# Altium project HW_SSB_LITE_R1.PrjPcb (part 1 of 2)
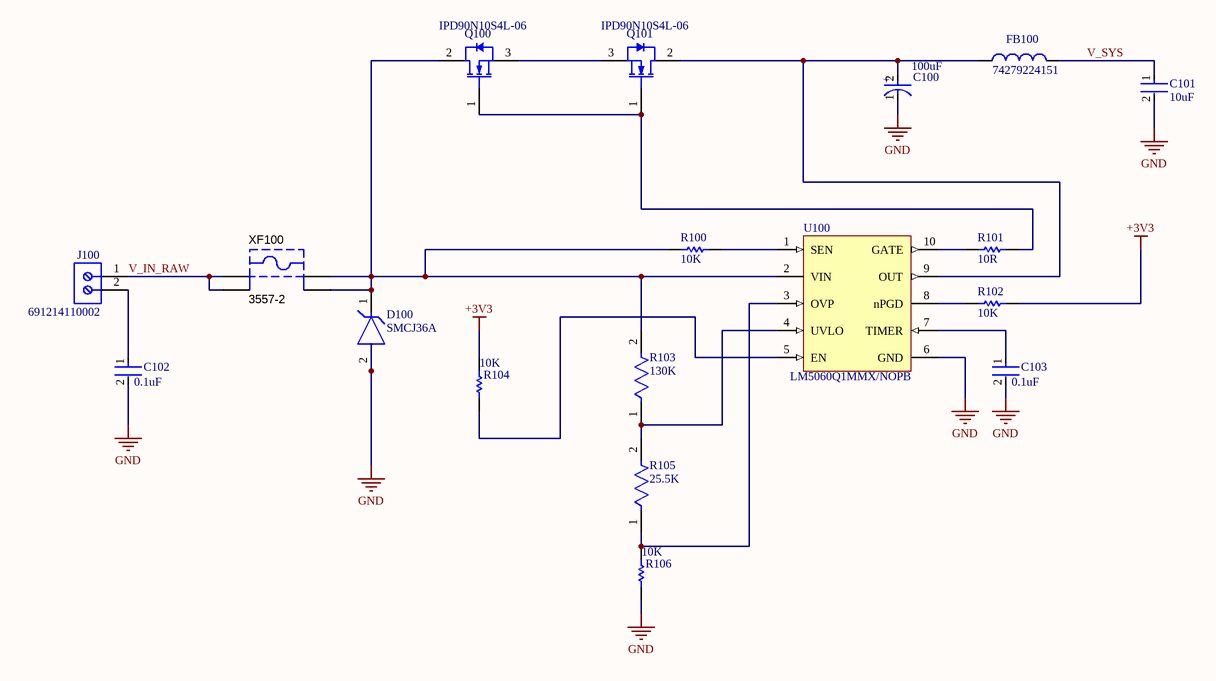
[diagram p0: Sheet1.SchDoc]
6 sheets, 147 parts. Net scope: global (net labels, ports and power ports of the same name join across sheets).
Board file: HW_SSB.PcbDoc
Sheets:
  Sheet1.SchDoc
  Sheet2.SchDoc
  Sheet3.SchDoc
  Sheet4.SchDoc
  Sheet5.SchDoc
  Sheet6.SchDoc

## Sheet Sheet1.SchDoc
size A4; SheetNumber: 1; SheetTotal: 6

### Parts
C100  100uF  [FP-RAD-TH-D_8_0_5-L_11_5-MFG]
C101  10uF  [FP-C3225-250-0_4-IPC_A]
C102  0.1uF  [FP-C1206C-EB-MFG]
C103  0.1uF  [FP-C1206C-EB-MFG]
D100  SMCJ36A  [FP-SMCJ-MFG]
FB100  74279224151  [WE-MPSB_2220_L5.6W5.1H1.8]
J100  691214110002  [691214110002]
Q100  IPD90N10S4L-06  [INF-PG-TO252-3-313_M]
Q101  IPD90N10S4L-06  [INF-PG-TO252-3-313_M]
R100  10K  [RESC1609X50X30NL8T20]
R101  10R  [RESC1608X55X25NL10T15]
R102  10K  [RESC1609X50X30NL8T20]
R103  130K  [FP-CRCW0603-e3-IPC_C]
R104  10K  [RESC1609X50X30NL8T20]
R105  25.5K  [FP-CRCW0603-e3-IPC_A]
R106  10K  [RESC1609X50X30NL8T20]
U100  LM5060Q1MMX/NOPB  [DGS0010A_M]
XF100  3557-2  [KSTN-3557-2]

### Nets
+3V3: R102.1 R104.2  [project net ESP_SCL]
GND: C100.1(C) C101.2 C102.2 C103.2 D100.2(A) R106.1 U100.6(GND)
V_SYS: C101.1 FB100.2
V_IN_RAW: J100.1 XF100.1 XF100.2
NetC100_2: C100.2(A) FB100.1 Q101.2(DRAIN) U100.9(OUT)
NetC102_1: C102.1 J100.2
NetC103_1: C103.1 U100.7(TIMER)
NetD100_1: D100.1(C) Q100.2(DRAIN) R100.2 R103.2 U100.2(VIN) XF100.3 XF100.4
NetQ100_1: Q100.1(GATE) Q101.1(GATE) R101.2
NetQ100_3: Q100.3(SOURCE) Q101.3(SOURCE)
NetR100_1: R100.1 U100.1(SEN)
NetR101_1: R101.1 U100.10(GATE)
NetR102_2: R102.2 U100.8(nPGD)
NetR103_1: R103.1 R105.2 U100.4(UVLO)
NetR104_1: R104.1 U100.5(EN)
NetR105_1: R105.1 R106.2 U100.3(OVP)

### Notes on the sheet
- (in symbol CMP-05427-002079-1) +

### Library data of the parts
C100 = CMP-05427-002079-1: Aluminum Electrolytic Capacitors (Radial Lead Type) 100uF ±20% 50V; ESR (Equivalent Series Resistance): 61mR; Lead Diameter: 0.6mm; Ripple Current (AC): 870mA; Life (Hours): 6000Hour; Lead/Base Style: Straight; Height - Seated (Max): 0.512inch; Height: 11.5mm; REACH SVHC: No SVHC; Contact Plating: Tin; Impedance: 61mR; Capacitance: 100uF; Voltage: 50V; Termination: Radial; Series: FR; Voltage Rating: 50V; Lead Pitch: 3.5mm; Diameter: 8mm; Number of Pins: 2; Min Operating Temperature: -40°C; Mount: Through Hole; Ripple Current: 870mA; Radiation Hardening: No; Length: 11.5mm; Max Operating Temperature: 105°C; Construction: RADIAL; Packaging: Bulk; Package Quantity: 200; Case/Package: Radial; RoHS Compliant: Yes; Voltage Rating (DC): 50V; Tolerance: 20%
C101 = CMP-08246-007101-1: Multilayer Ceramic Capacitors 10uF ±10% 50V X7R SMD 1210; RoHS Compliant: Yes
C102 C103 = CMP-03020-005759-1: CAP CER 0.1UF 50V X7R 1206; Manufacturer: KEMET; Manufacturer Part Number: C1206C104K5RACAUTO; Capacitance: 0.10 μF; Temperature Coefficient: 15%; Value: 0.10 μF; Material: Ceramic; Automotive Grade: Grade 0; Tolerance: 0.1; RoHS: TRUE; Lead Free: Yes; ComponentLink2Description: Datasheet; Automotive: Yes; Temperature Characteristic: X7R; Temperature Range Low: -55°C; Voltage Rating: 50 V; Device Class L1: Passive Components; Ipc Land Pattern Name: CAPC320160X78; Mouser Description: Multilayer Ceramic Capacitors MLCC - SMD/SMT 0.1uF 50volts 10% X7R AUTO; Octopart: https://octopart.com/c1206c104k5racauto-kemet-12595586; Device Class L3: Ceramic Capacitors; Digikey Description: CAP CER 0.1UF 50V X7R 1206; Temperature Range High: +150°C; Temperature: -55°C to +150°C; Device Class L2: Capacitors; ComponentLink2URL: https://content.kemet.com/datasheets/KEM_C1007_X8R_ULTRA_150C_SMD.pdf; Package: C1206C-EB; Category: Cap; Height: 0.88mm
D100 = CMP-2000-07108-2: TVS DIODE 36V 58.1V DO214AB; Max Reverse Leakage Current: 1uA; Max Surge Current: 25.9A; Min Breakdown Voltage: 40V; Peak Pulse Power: 1.5kW; Polarity: Unidirectional; Number of Elements: 1; Max Power Dissipation: 6.5W; Max Breakdown Voltage: 44.2V; Power Line Protection: No; Test Current: 1mA; Element Configuration: Single; Case/Package: SMC; Peak Pulse Current: 25.9A; Length: 7.11mm; Height: 2.417mm; Power Dissipation: 1.5kW; Max Operating Temperature: 150°C; Direction: Unidirectional; Min Operating Temperature: -65°C; Operating Supply Voltage: 36V; Breakdown Voltage: 40V; Reverse Standoff Voltage: 36V; REACH SVHC: No SVHC; Lead Free: Lead Free; Voltage Rating (DC): 36V; Number of Channels: 1; Number of Unidirectional Channels: 1; Mount: Surface Mount; Clamping Voltage: 58.1V; Number of Pins: 2; Composition: Zener; Termination: SMD/SMT; Reverse Breakdown Voltage: 40V; Leakage Current: 1uA; Width: 6.22mm; Radiation Hardening: No; Packaging: Tape and Reel; Package Quantity: 3000
FB100 = CMP-1413-00001-2: NexarPartId: 21273886; Current Rating: 5A; Tolerance: 25%; Number of Lines: 1; Frequency: 700MHz; DC Resistance (DCR): 7mΩ; Test Frequency: 100MHz; Material: Ferrite, Steel; Impedance: 150Ω; Max Operating Temperature: 125°C; Length: 5.6mm; Width: 5.1mm; Height: 1.8mm; Max DC Current: 5A; Case Code (Metric): 5650; RoHS: Compliant; Termination: SMD/SMT; Packaging: Digi-Reel®; Depth: 5.08mm; Max Current Rating: 5A; REACH SVHC: Unknown; Case Code (Imperial): 2220; Min Operating Temperature: -55°C; Case/Package: 2220; Mount: Surface Mount
J100 = CMP-1502-02464-3: 2141 Series 3.5MM Pitch Straight, Pcb Terminal Block, Through Hole, 2 Way; Plating: Brass, Steel; Wire Gauge (Min): 16AWG; Number of Contacts: 2; Current: 10A; Stripping Length: -6mm; Voltage Rating: 300V; Pitch: 3.5052mm; Wire Gauge (Max): 24AWG; Number of Levels: 1; Lead Pitch: 3.5mm; Width: 7.9mm; Packaging: Box; RoHS: Compliant; Number of Rows: 1; Min Operating Temperature: -40°C; Mount: Through Hole; Number of Pins: 2; Contact Plating: Brass, Tin; Housing Material: Nylon; Current Rating: 10A; Termination: Screw; Color: Blue, Green; Number of Positions Per Level: 2; Height: 8.7mm; Voltage: 300V; Max Operating Temperature: 105°C; Wire/Cable Gauge: 24AWG; Length: 7.4mm; Contact Material: Tin
Q100 Q101 = CMP-1138-00161-1: OptiMOS-T2 Power-Transistor, 100 V VDS, 90 A ID, PG-TO252-3-313, Reel, Green; Manufacturer: Infineon; RthJC (max): 1.1 K/W; VGS(th) (min): 1.1 V; IDpuls (max): 360 A; VDS (max): 100 V; RDS (on) (max) (@4.5V): 8.1 mOhm; ID (max): 90 A; Ptot (max): 136 W; RDS (on) (max) (@10V): 6.6 mOhm; Green: TRUE; VGS(th) (max): 2.1 V; QG: 75 nC; Halogen-free: TRUE; PackageVersion: Oct-10; Mounting Technology: Surface Mount; ComponentLink1Description: Manufacturer URL; ComponentLink2Description: Datasheet; ComponentLink1URL: http://www.infineon.com/; PackageReference: PG-TO252-3-313; Technology: OptiMOS-T2; ComponentLink3Description: Package Specification; Packing: Reel; DatasheetVersion: Rev. 1.0; ComponentLink3URL: http://www.infineon.com/dgdl/PG-TO252-3-313-Package_Overview.pdf?folderId=db3a30432b57a660012b81890ade72d2&fileId=db3a30432b57a660012b8193af2872eb; PackageDescription: 3-Pin Plastic (Green) Transistor Single Outline Package, 6.5 x 6.12 mm Body, 2.28 mm Pitch; ComponentLink2URL: http://www.infineon.com/dgdl/IPD90N10S4L-06_DS_1_0.pdf?folderId=db3a3043156fd5730115c7d50620107c&fileId=db3a3043372d5cc80137500063630512&location=en.Products.Automotive_ICs.Automotive_MOSFETs.Single__N-Channel_100V_MOSFETs.DATASHEET.IPD90N10S4L-06_DS_1_0.p; PartNumber: IPD90N10S4L-06
R100 R102 R104 R106 = CMP-1666-00005-4: Chip Resistor, 10 KOhm, +/- 1%, 100 mW, -55 to 155 degC, 0603 (1608 Metric), RoHS, Tape and Reel; Manufacturer: Vishay Semiconductor; Voltage Rating: 75 V; Max Operating Temperature: 155 degC; PackageDescription: 2-Pin Surface Mount Device, Body 1.575 x 0.85 mm; ComponentLink1Description: Manufacturer URL; RoHSCompliant: true; PackageReference: 0603; REACH SVHC: Unknown; Length: 1.55 mm; DatasheetVersion: 06/2012; Packaging: Tape and Reel; Min Operating Temperature: -55 degC; Mounting Technology: Surface Mount; ComponentLink2URL: https://datasheet.ciiva.com/11809/0900766b80d98afc-11809037.pdf; Height: 0.45 mm; ComponentLink2Description: Datasheet; Package Quantity: 5000; ComponentLink1URL: http://www.vishay.com/
R101 = CMP-1659-00008-4: Chip Resistor, 10 Ohm, +/- 1%, 0.1 W, -55 to 155 degC, 0603 (1608 Metric), RoHS, Tape and Reel; Manufacturer: Yageo; Voltage Rating: 50 V; PackageReference: 0603; ComponentLink3Description: Package Specification; Packaging: Tape and Reel; Max Operating Temperature: 155 degC; ComponentLink3URL: http://www.farnell.com/datasheets/443971.pdf; PackageDescription: 2-Pin Surface Mount Device, Body 1.6 x 0.8 mm; ComponentLink1URL: http://www.yageo.com/; Pins: 2; REACH SVHC: No SVHC; RoHSCompliant: true; ComponentLink2URL: http://www.yageo.com/documents/recent/PYu-RC_Group_51_RoHS_L_04.pdf; DatasheetVersion: Rev. 4, 02/2016; Mount: Surface Mount; Package Quantity: 200; Min Operating Temperature: -55 degC; Height: 0.45 mm; Mounting Technology: Surface Mount; ComponentLink1Description: Manufacturer URL; ComponentLink2Description: Datasheet; Length: 1.6 mm
R103 = CMP-2000-03887-2: RES Thick Film, 130kΩ, 1%, 0.1W, 100ppm/°C, 0603; Resistance: 130kR; Power Rating: 100mW; Voltage Rating: 75V; Width: 0.033inch; Lead Free: Lead Free; Case Code (Imperial): 0603; Radiation Hardening: No; Termination: SMD/SMT; Tolerance: 1%; Packaging: Tape and Reel; Length: 1.55mm; Height: 0.45mm; Composition: Thick Film; Max Power Dissipation: 100mW; Max Operating Temperature: 155°C; Temperature Coefficient: 100ppm/°C; Voltage Rating (DC): 75V; Case Code (Metric): 1608; Case/Package: 0603; Military Standard: Not; Features: Automotive AEC-Q200; Number of Pins: 2; Weight: 7.1E-05oz; Min Operating Temperature: -55°C; Depth: 0.85mm; Number of Terminations: 2; Contact Plating: Tin; Package Quantity: 10
R105 = CMP-2000-03129-2: RES Thick Film, 25.5kΩ, 1%, 0.1W, 100ppm/°C, 0603; Power Rating: 100mW; Voltage Rating (DC): 75V; Resistance: 25.5kR; Termination: SMD/SMT; Temperature Coefficient: 100ppm/°C; Lead Free: Lead Free; Features: Automotive AEC-Q200; Case/Package: 0603; Width: 0.033inch; Min Operating Temperature: -55°C; Number of Pins: 2; Package Quantity: 10; Case Code (Metric): 1608; Military Standard: Not; Case Code (Imperial): 0603; Length: 1.55mm; Composition: Thick Film; Max Operating Temperature: 155°C; Height: 0.45mm; Number of Terminations: 2; Packaging: Tape and Reel; Radiation Hardening: No; Depth: 0.85mm; Tolerance: 1%; Contact Plating: Tin; Working Voltage: 75V; Weight: 7.1E-05oz; Max Power Dissipation: 100mW; Voltage Rating: 75V
U100 = CMP-0069-01838-4: High-Side Protection Controller with Low Quiescent Current, 10-pin MSOP, Pb-Free; Manufacturer: Texas Instruments; PackageTopMarking: ZXTT*SZAB; High-Reliability: Y; CompType: Switcher; PackageDescription: Mini-SO, Molded, .118 x .118 x .034in Body, 10 Lead, .0197in Pitch; PowerWise: Y; PinCount: 10; Code_JEDEC: MO-187-BA; ComponentLink1URL: http://www.ti.com/general/docs/lit/getliterature.tsp?genericPartNumber=LM5060-Q1&fileType=pdf; ComponentLink1Description: Datasheet URL; PackageReference: DGS0010A; RoHS: Y; PartNumber: LM5060Q1MMX/NOPB
XF100 = CMP-2000-05461-1: FUSE HOLDER, PCB MOUNT, 500VAC, 20A, ROHS; Manufacturer: Keystone-Electronics; Number of Circuits: 1; Voltage: 500V; Fuseholder Type: Block; Fuse Type: Blade; Fuse Size: 0.43"Lx0.15"Wx0.64"H(10.92mmx3.81mmx16.25mm); For Use With/Related Products: ATC,ATO257,MINI897; Current Rating: 30A; Datasheet URL: http://datasheet.octopart.com/3557-2-Keystone-datasheet-15715937.pdf; Orientation: Vertical; Family: Fuseholders; Datasheet Version: Apr-13; Contact Finish: TinNickel; Mounting Type: PCB; Series: -; Category: CircuitProtection; Termination Style: PCPin; Contact Material: Brass; Manufacturer URL: http://www.keyelco.com/

## Sheet Sheet2.SchDoc
size A4; SheetNumber: 2; SheetTotal: 6
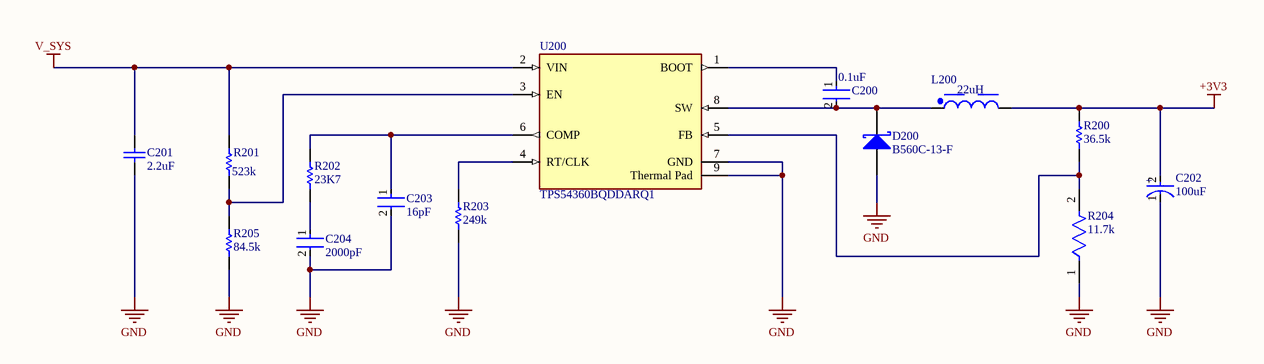
[diagram p1: Sheet2.SchDoc]

### Parts
C200  0.1uF  [FP-CC0805-0_85-MFG]
C201  2.2uF  [CAPC3225X250X20LL40]
C202  100uF  [FP-POSCAP-D2E-MFG]
C203  16pF  [FP-C0603C-CF-MFG]
C204  2000pF  [FP-C0805C-DN-MFG]
D200  B560C-13-F  [DIOD-B5X0C-2_M]
L200  22uH  [WE-TI_8095]
R200  36.5k  [RESC0603X28X15ML05T05]
R201  523k  [RESC1005X40X25NL05T10]
R202  23K7  [RESC0201(0603)_M]
R203  249k  [RESC0603X28X15LL05T05]
R204  11.7k  [FP-RT0805-MFG]
R205  84.5k  [RESC1005X40X25ML05T10]
U200  TPS54360BQDDARQ1  [FP-DDA0008E-MFG]

### Nets
+3V3: C202.2(A) L200.2 R200.2  [project net ESP_SCL]
GND: C201.1 C202.1(C) C203.2 C204.2 D200.2(A) R203.1 R204.1 R205.1 U200.7(GND) U200.9(Thermal_Pad)
V_SYS: C201.2 R201.2 U200.2(VIN)
NetC200_1: C200.1 U200.1(BOOT)
NetC200_2: C200.2 D200.1(K) L200.1 U200.8(SW)
NetC203_1: C203.1 R202.2 U200.6(COMP)
NetC204_1: C204.1 R202.1
NetR200_1: R200.1 R204.2 U200.5(FB)
NetR201_1: R201.1 R205.2 U200.3(EN)
NetR203_2: R203.2 U200.4(RT/CLK)

### Notes on the sheet
- (in symbol CMP-05428-001405-1) +

### Library data of the parts
C200 = CMP-2100-03606-3: CAP CER 0.1UF 50V X7R 0805; Manufacturer Part Number: CC0805KRX7R9BB104; Manufacturer: Yageo; Tolerance: 0.1; Capacitance: 100 nF; Value: 100 nF; Material: Ceramic; Device Class L1: Passive Components; ComponentLink2Description: Datasheet; Package: CC0805-0.85; Digikey Description: CAP CER 0.1UF 50V X7R 0805; Device Class L3: Ceramic Capacitors; Temperature: -30°C to +85°C; Temperature Characteristic: X7R; Voltage Rating: 50 V; Height: 0.95mm; RoHS: TRUE; Ipc Land Pattern Name: CAPC200125X85; Device Class L2: Capacitors; Category: Cap; Temperature Range Low: -30°C; Temperature Range High: +85°C; Mouser Description: Multilayer Ceramic Capacitors MLCC - SMD/SMT 100nF 50V X7R 10%; Footprint Url: http://www.yageo.com/exep/pages/download/literatures/UPY-C_GEN_24.pdf; Automotive: No; Octopart: https://octopart.com/cc0805krx7r9bb104-yageo-192993; Lead Free: Yes; ComponentLink2URL: http://www.yageo.com/documents/recent/UPY-GPHC_Y5V_6.3V-to-50V_8.pdf
C201 = CMP-2000-06053-1: Chip Capacitor, 2.2 uF, +/- 10%, -55 to 125 degC, 1210 (3225 Metric), RoHS, Tape and Reel; PCN Part Number: MLCCPartNumberChange30/Nov/2012; Manufacturer: TDK; Capacitance: 2.2µF; Catalog Drawings: CSERIES_1210_2.5; Product Training Modules: SEAT,CCV,andTVCLDesignToolsGuidetoReplacinganElectrolyticCapacitorwithanMLCC; Other Names: 445-4497-6; Voltage - Rated: 100V; Temperature Coefficient: X7R; Featured Product: C-SeriesMidVoltageMLCCs; Online Catalog: CSeries,MidVoltage; Ratings: -; Mounting Technology: SurfaceMount; Height - Seated (Max): -; Applications: GeneralPurpose; Packaging: Digi-Reel®; Mounting Type: SurfaceMount,MLCC; Lead Spacing: -; Thickness (Max): 0.098"(2.50mm); Package Reference: 1210 (3225 Metric); Manufacturer URL: http://www.tdk.com/; Size / Dimension: 0.126"Lx0.098"W(3.20mmx2.50mm); Operating Temperature: -55°C~125°C; Datasheet URL: https://datasheet.ciiva.com/15192/getdatasheetpartid-725361-15192330.pdf; RoHS Information: RoHSCertificate-MLCC; Lead Style: -; Standard Package: 1; Family: CeramicCapacitors; Datasheet Version: 10/2014; Category: Capacitors; Tolerance: ±10%; Features: -; Series: C; Package Description: 2-Pin Surface Mount Device, Body 3.2 x 2.5 mm; Package / Case: 1210(3225Metric)
C202 = CMP-05428-001405-1: Molded Tantalum Polymer Capacitor 100uF 20% 6.3V life 2000Hours SMD 2917; ESR (Equivalent Series Resistance): 18mR; Polarity: Polar; Ripple Current: 2.8A; Leakage Current: 63uA; Dissipation Factor: 10%; Width: 4.3mm; Tolerance: 20%; Material: Polymer; Case/Package: 2917; Voltage Rating (DC): 6.3V; Capacitance: 100uF; Case Code (Metric): 7343; Features: General Purpose; Package Quantity: 3000; Voltage: 6.3V; Lead Free: Lead Free; Voltage Rating: 6.3V; Length: 7.3mm; Construction: Flat; RoHS Compliant: Yes; Height - Seated (Max): 0.079inch; Series: POSCAP™ TPE; Radiation Hardening: No; Case Code (Imperial): 2917; REACH SVHC: No SVHC; Max Operating Temperature: 105°C; Mount: Surface Mount; Depth: 4.3mm; Height: 1.8mm; Min Operating Temperature: -55°C; Packaging: Tape and Reel; Termination: SMD/SMT
C203 = CMP-1035-00716-3: CAP CER 16PF 50V 5% NP0 0603; Manufacturer Part Number: C0603C160J5GACTU; Manufacturer: KEMET; Automotive Grade: Grade 1; Material: Ceramic; Temperature Coefficient: 30ppm/°C; Tolerance: 0.05; Temperature Characteristic: C0G; Octopart: https://octopart.com/c0603c160j5gactu-kemet-9143816; ComponentLink2URL: https://api.kemet.com/component-edge/download/datasheet/C0603C100J5GACAUTO.pdf; Category: Cap; Mouser Description: Multilayer Ceramic Capacitors MLCC - SMD/SMT 50volts 16pF C0G 5%; Device Class L1: Passive Components; Capacitance: 16 pF; Voltage Rating: 50 V; Temperature Range Low: -55°C; Automotive: Yes; Device Class L3: Ceramic Capacitors; Package: C0603C-CF; Temperature Range High: +125°C; Digikey Description: CAP CER 16PF 50V 5% NP0 0603; Value: 16 pF; Lead Free: Yes; Height: 0.87mm; Device Class L2: Capacitors; Temperature: -55°C to +125°C; ComponentLink2Description: Datasheet; RoHS: TRUE
C204 = CMP-1036-03225-3: CAP CER 2000PF 25V 5% NP0 0805; Manufacturer Part Number: C0805C202J3GACTU; Manufacturer: KEMET; Value: 2,000 pF; Material: Ceramic; Temperature Characteristic: C0G; Temperature Coefficient: 30ppm/°C; Tolerance: 0.05; Package: C0805C-DN; Category: Cap; ComponentLink2URL: https://content.kemet.com/datasheets/KEM_C1003_C0G_SMD.pdf; ComponentLink2Description: Datasheet; Device Class L3: Ceramic Capacitors; Device Class L1: Passive Components; Octopart: https://octopart.com/c0805c202j3gactu-kemet-11998870; Voltage Rating: 25 V; Height: 0.88mm; Ipc Land Pattern Name: CAPC200125X78; Temperature: -55°C to +125°C; Capacitance: 2,000 pF; Lead Free: Yes; Automotive: No; Temperature Range High: +125°C; Temperature Range Low: -55°C; Mouser Description: Cap Ceramic 0.002uF 25V C0G 5% SMD 0805 125°C Paper T/R; RoHS: TRUE; Digikey Description: CAP CER 2000PF 25V 5% NP0 0805; Device Class L2: Capacitors
D200 = CMP-2000-05098-2: Schottky Barrier Rectifier, 5 A, 60 V, -55 to 125 degC, 2-Pin SMD, RoHS, Tape and Reel; Ir - Reverse Current: 500uA; Configuration: Single; Ifsm - Forward Surge Current: 100A; Vrrm - Repetitive Reverse Voltage: 60V; Brand: DiodesIncorporated; Vf - Forward Voltage: 0.7V; If - Forward Current: 5A; Unit Weight: 0.007408oz; Type: SchottkyBarrierRectifier; Package / Case: SMC; Manufacturer URL: http://www.diodes.com/; Datasheet URL: https://datasheet.ciiva.com/27052/1538961-27052355.pdf; Factory Pack Quantity: 3000; Height: 2.5mm; Width: 6.22mm; Product Category: SchottkyDiodes&Rectifiers; Minimum Operating Temperature: -55C; Manufacturer: DiodesIncorporated; Datasheet Version: Rev. 7-2, 06/2007; Product: SchottkyDiodes; Maximum Operating Temperature: +125C; Operating Temperature Range: -55Cto+125C; Technology: Si; Length: 7.11mm; RoHS: True; Packaging: Reel; Termination Style: SMD/SMT; Series: B560; Mounting Style: SMD/SMT
L200 = CMP-03913-110288128-3: Inductor, 22Uh, Unshielded, 3A, Rad Rohs Compliant: Yes; Inductance: 22µH; Voltage Rating: 80V; DC Resistance (DCR): 46mΩ; Ambient Temperature Range High: 85°C; Ambient Temperature Range Low: -40°C; Current Rating: 3A; RoHS: Compliant; Max Operating Temperature: 125°C; Min Operating Temperature: -40°C; Length: 7.8mm; Width: 7.8mm; Height: 9.5mm
R200 = CMP-2004-00521-1: 100mW Thick Film Resistors 75V ±1% ±100ppm/℃ 36.5kΩ 0603 Chip Resistor - Surface; Manufacturer: Vishay Dale; Part Number: CRCW020136K5FNED
R201 = CMP-2002-07734-1: RES 523K OHM 1% 1/16W 0402; Part Number: RC0402FR-07523KL; Manufacturer: Yageo / Phycomp
R202 = CMP-1010-00569-1: 23K7 0.05W 1% 0201 (0603 Metric)  SMD; Case-Metric: 0603; Case-EIA: 0201; Value: 23700.00 Ohm; Power: 0.05 W; Tolerance: 1 %; Technology: SMT
R203 = CMP-1010-00685-2: Res Thick Film 0603 2.2K Ohm 1% 0.1W(1/10W) ±100ppm/C SMD AutomoTEXASve T/R; Part Number: CRCW0201249KFKED; Manufacturer: Vishay Dale
R204 = CMP-03412-011069-1: RES 11.7K OHM 0.1% 1/8W 0805; Manufacturer: Yageo; Manufacturer Part Number: RT0805BRD0711K7L; Resistance: 11.7kΩ; Voltage Rating: 150V; Value: 11.7kΩ; Temperature Coefficient: 25ppm/°C; Power Rating: 0.125W; RoHS: TRUE; Composition: Thin Film; Height: 0.6mm; Automotive: No; Tolerance: 0.1%; Package: RT0805; Device Class L2: Resistors; Footprint Url: http://www.yageo.com/exep/pages/download/literatures/PYu-R_Mount_10.pdf; ComponentLink2Description: Datasheet; Device Class L1: Passive Components; Temperature Range High: +155°C; Device Class L3: Chip SMD Resistors; Temperature Range Low: -55°C; Lead Free: Yes; ComponentLink2URL: http://www.yageo.com/documents/recent/PYu-RT_1-to-0.01_RoHS_L_9.pdf; Octopart: https://octopart.com/rt0805brd0711k7l-yageo-78404094; Ipc Land Pattern Name: RESC200125X50; Series: RT; Mouser Description: High Precision-High Stability Chip Resistor Thin Film 0805 11.7kOhm 0.1% Paper T/R; Temperature: -55°C to +155°C; Category: Res; Digikey Description: RES 11.7K OHM 0.1% 1/8W 0805
R205 = CMP-2002-07822-1: RES 84.5K OHM 1% 1/16W 0402; Manufacturer: Yageo / Phycomp; Part Number: RC0402FR-0784K5L
U200 = CMP-04918-000007-1: IC REG BCK SPLIT RAIL ADJ 8SOPWR; Manufacturer: Texas Instruments; Switching Topology: Buck; Max Junction Temp: +150°C; Max Supply Voltage: 60V; Number Of Outputs: 1; Min Supply Voltage: 4.5V; Output Voltage: 0.8-58.8V; Output Type: AdjustableProgrammable; Output Current: 3.5A; Max Duty Cycle: 98%; Nominal Supply Current: 146uA; Automotive Grade: Grade 1; Switching Frequency: 100-2500kHz; Standoff Height: 0mm; Automotive: Yes; RoHS: TRUE; Category: IC; Temperature Range Low: -40°C; Ambient Temperature Range Low: -40°C; Digikey Description: IC REG BCK SPLIT RAIL ADJ 8SOPWR; Lead Free: Yes; Device Class L3: Voltage Regulators - Switching; Octopart: https://octopart.com/tps54360bqddarq1-texas+instruments-80336296; ComponentLink2URL: http://www.ti.com/lit/ds/symlink/tps54360b-q1.pdf; Temperature Range High: +125°C; Temperature: -40°C to +125°C; Ambient Temperature Range High: +125°C; Device Class L2: Power Management ICs; Device Class L1: Integrated Circuits (ICs); Package: DDA0008E; Height: 1.7mm; Manufacturer Part Number: TPS54360BQDDARQ1; ComponentLink2Description: Datasheet

## Sheet Sheet3.SchDoc
size A2; SheetNumber: 3; SheetTotal: 6
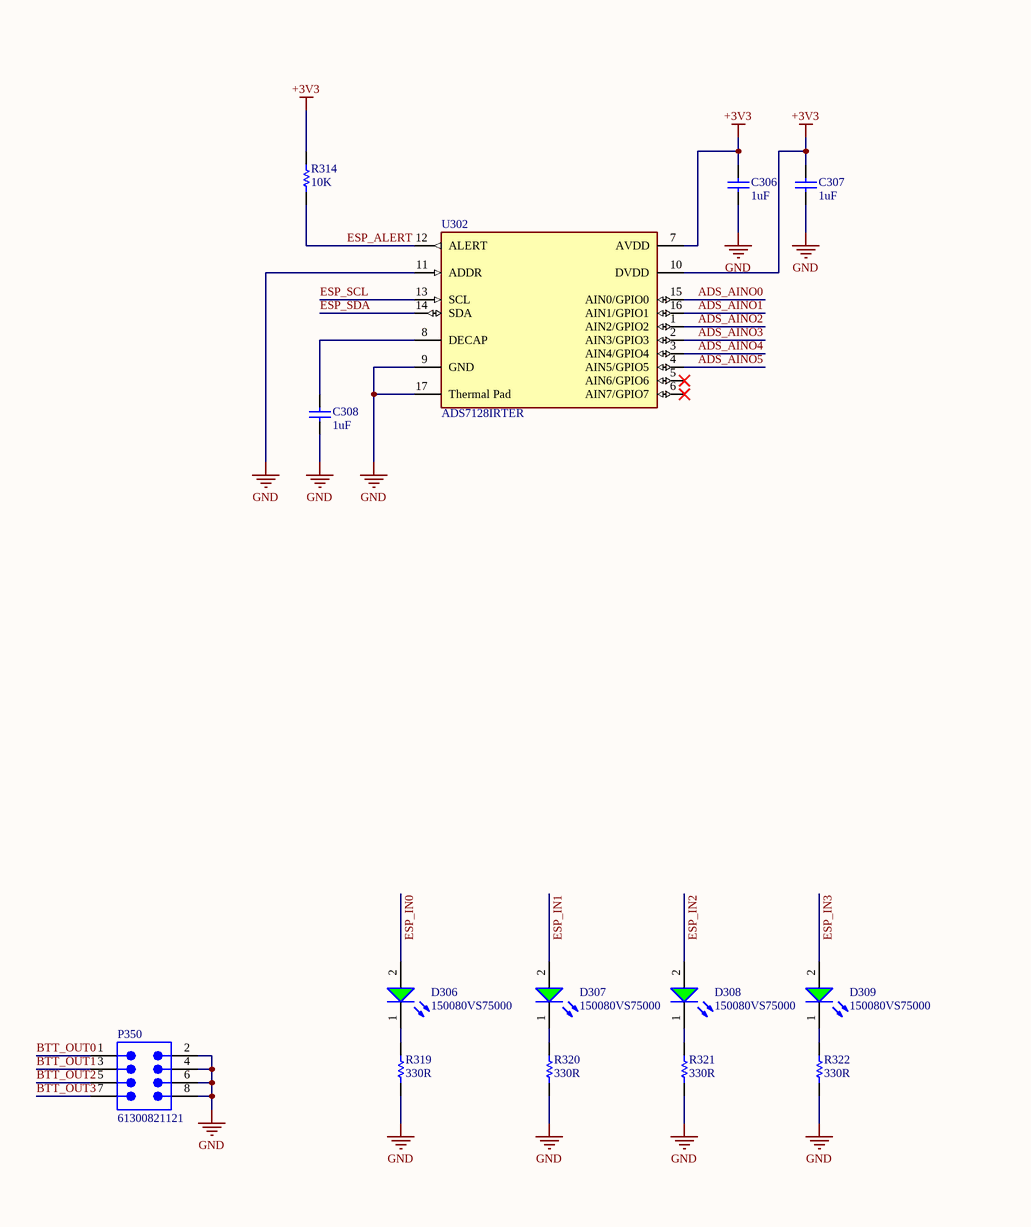
[diagram p2: Sheet3.SchDoc, left]
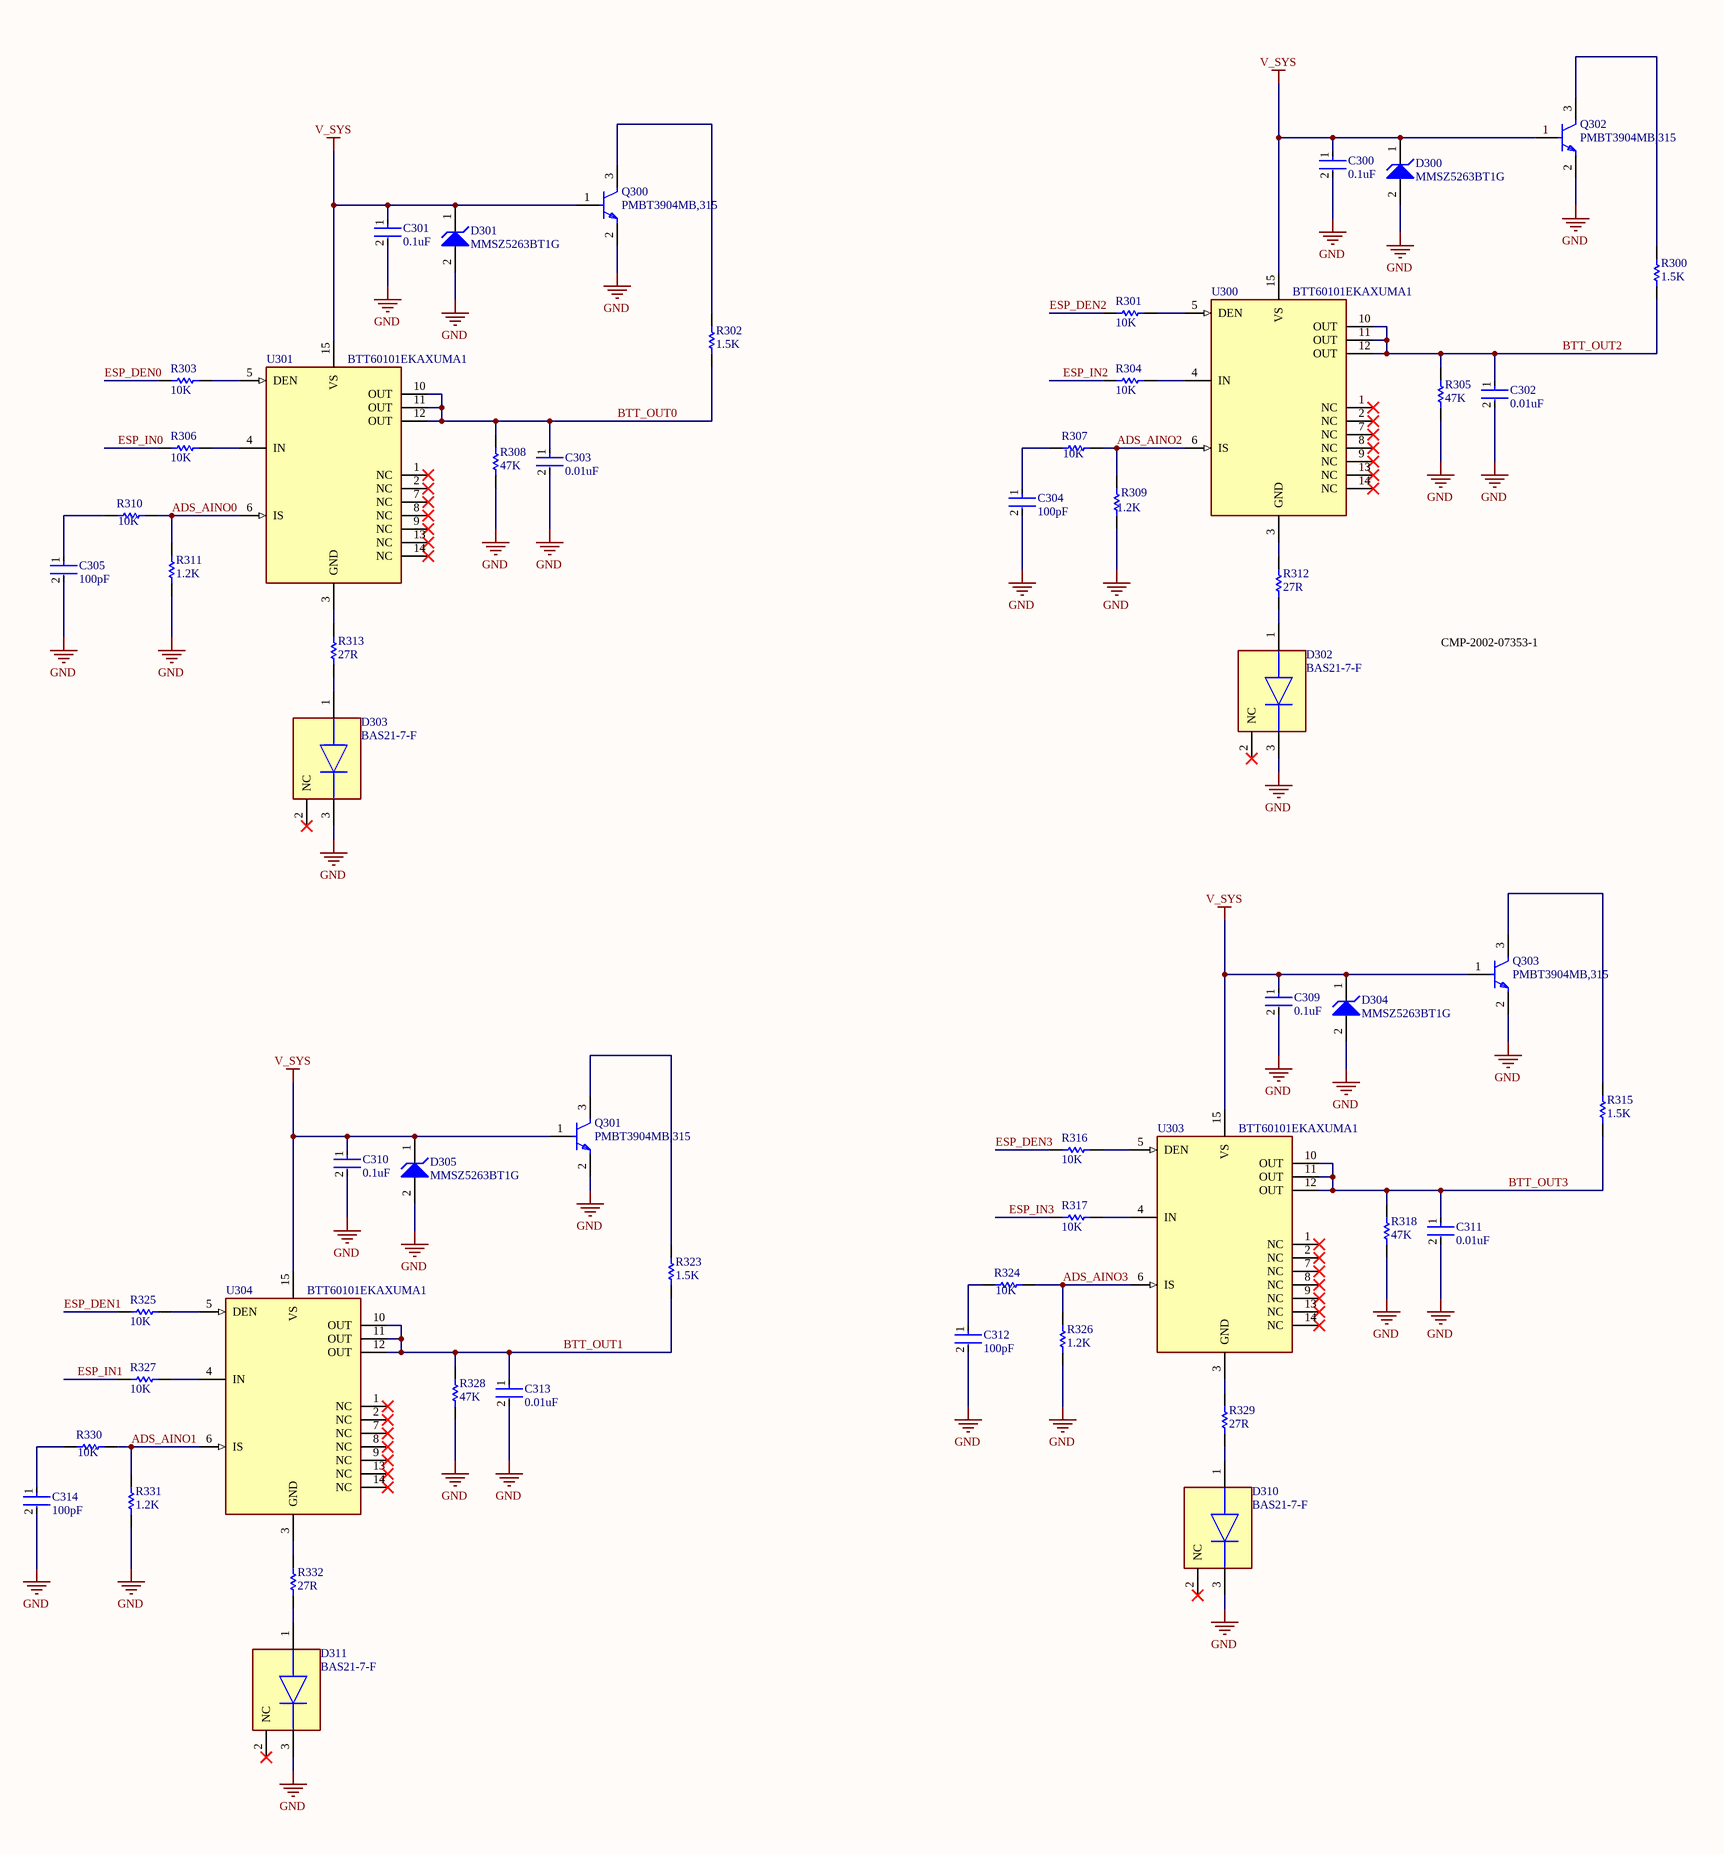
[diagram p3: Sheet3.SchDoc, right]

### Parts
C300  0.1uF  [FP-GRM155-0_05-IPC_B]
C301  0.1uF  [FP-GRM155-0_05-IPC_B]
C302  0.01uF  [FP-GRM155-0_05-IPC_C]
C303  0.01uF  [FP-GRM155-0_05-IPC_C]
C304  100pF  [FP-C0402-BB-MFG]
C305  100pF  [FP-C0402-BB-MFG]
C306  1uF  [CAPC1608X90X35LL10T15]
C307  1uF  [CAPC1608X90X35LL10T15]
C308  1uF  [CAPC1608X90X35LL10T15]
C309  0.1uF  [FP-GRM155-0_05-IPC_B]
C310  0.1uF  [FP-GRM155-0_05-IPC_B]
C311  0.01uF  [FP-GRM155-0_05-IPC_C]
C312  100pF  [FP-C0402-BB-MFG]
C313  0.01uF  [FP-GRM155-0_05-IPC_C]
C314  100pF  [FP-C0402-BB-MFG]
D300  MMSZ5263BT1G  [ONSC-SOD-123-2-425-04_V]
D301  MMSZ5263BT1G  [ONSC-SOD-123-2-425-04_V]
D302  BAS21-7-F  [FP-SOT23-MFG]
D303  BAS21-7-F  [FP-SOT23-MFG]
D304  MMSZ5263BT1G  [ONSC-SOD-123-2-425-04_V]
D305  MMSZ5263BT1G  [ONSC-SOD-123-2-425-04_V]
D306  150080VS75000  [WL-SMCW_0805_150080xx75000]
D307  150080VS75000  [WL-SMCW_0805_150080xx75000]
D308  150080VS75000  [WL-SMCW_0805_150080xx75000]
D309  150080VS75000  [WL-SMCW_0805_150080xx75000]
D310  BAS21-7-F  [FP-SOT23-MFG]
D311  BAS21-7-F  [FP-SOT23-MFG]
P350  61300821121  [61300821121]
Q300  PMBT3904MB,315  [FP-SOT883B-MFG]
Q301  PMBT3904MB,315  [FP-SOT883B-MFG]
Q302  PMBT3904MB,315  [FP-SOT883B-MFG]
Q303  PMBT3904MB,315  [FP-SOT883B-MFG]
R300  1.5K  [RESC1005X40X25ML05T10]
R301  10K  [RESC1005X40X25LL05T10]
R302  1.5K  [RESC1005X40X25ML05T10]
R303  10K  [RESC1005X40X25LL05T10]
R304  10K  [RESC1005X40X25LL05T10]
R305  47K  [RESC1005X40X25ML05T10]
R306  10K  [RESC1005X40X25LL05T10]
R307  10K  [RESC1005X40X25LL05T10]
R308  47K  [RESC1005X40X25ML05T10]
R309  1.2K  [RESC1005X40X25ML05T10]
R310  10K  [RESC1005X40X25LL05T10]
R311  1.2K  [RESC1005X40X25ML05T10]
R312  27R  [RESC1005X40X25LL05T10]
R313  27R  [RESC1005X40X25LL05T10]
R314  10K  [RESC1005X40X25LL05T10]
R315  1.5K  [RESC1005X40X25ML05T10]
R316  10K  [RESC1005X40X25LL05T10]
R317  10K  [RESC1005X40X25LL05T10]
R318  47K  [RESC1005X40X25ML05T10]
R319  330R  [RESC1005X40X25LL05T10]
R320  330R  [RESC1005X40X25LL05T10]
R321  330R  [RESC1005X40X25LL05T10]
R322  330R  [RESC1005X40X25LL05T10]
R323  1.5K  [RESC1005X40X25ML05T10]
R324  10K  [RESC1005X40X25LL05T10]
R325  10K  [RESC1005X40X25LL05T10]
R326  1.2K  [RESC1005X40X25ML05T10]
R327  10K  [RESC1005X40X25LL05T10]
R328  47K  [RESC1005X40X25ML05T10]
R329  27R  [RESC1005X40X25LL05T10]
R330  10K  [RESC1005X40X25LL05T10]
R331  1.2K  [RESC1005X40X25ML05T10]
R332  27R  [RESC1005X40X25LL05T10]
U300  BTT60101EKAXUMA1  [FP-PG-DSO-14-MFG]
U301  BTT60101EKAXUMA1  [FP-PG-DSO-14-MFG]
U302  ADS7128IRTER  [FP-RTE0016C-MFG]
U303  BTT60101EKAXUMA1  [FP-PG-DSO-14-MFG]
U304  BTT60101EKAXUMA1  [FP-PG-DSO-14-MFG]

### Nets
ESP_SCL: C306.2 C307.2 R314.2 U302.7(AVDD) U302.10(DVDD) U302.13(SCL) U302.14(SDA)  [also labelled +3V3, ESP_SDA]
GND: C300.2 C301.2 C302.2 C303.2 C304.2 C305.2 C306.1 C307.1 C308.1 C309.2 C310.2 C311.2 C312.2 C313.2 C314.2 D300.2(A) D301.2(A) D302.3(C) D303.3(C) D304.2(A) D305.2(A) D310.3(C) D311.3(C) P350.2 P350.4 P350.6 P350.8 Q300.2(E) Q301.2(E) Q302.2(E) Q303.2(E) R305.1 R308.1 R309.1 R311.1 R318.1 R319.1 R320.1 R321.1 R322.1 R326.1 R328.1 R331.1 U302.9(GND) U302.11(ADDR) U302.17(Thermal_Pad)
V_SYS: C300.1 C301.1 C309.1 C310.1 D300.1(K) D301.1(K) D304.1(K) D305.1(K) Q300.1(B) Q301.1(B) Q302.1(B) Q303.1(B) U300.15(VS) U301.15(VS) U303.15(VS) U304.15(VS)
ADS_AINO0: R310.2 R311.2 U301.6(IS) U302.15(AIN0/GPIO0)
ADS_AINO1: R330.2 R331.2 U302.16(AIN1/GPIO1) U304.6(IS)
ADS_AINO2: R307.2 R309.2 U300.6(IS) U302.1(AIN2/GPIO2)
ADS_AINO3: R324.2 R326.2 U302.2(AIN3/GPIO3) U303.6(IS)
ADS_AINO4: U302.3(AIN4/GPIO4)
ADS_AINO5: U302.4(AIN5/GPIO5)
BTT_OUT0: C303.1 P350.1 R302.1 R308.2 U301.10(OUT) U301.11(OUT) U301.12(OUT)
BTT_OUT1: C313.1 P350.3 R323.1 R328.2 U304.10(OUT) U304.11(OUT) U304.12(OUT)
BTT_OUT2: C302.1 P350.5 R300.1 R305.2 U300.10(OUT) U300.11(OUT) U300.12(OUT)
BTT_OUT3: C311.1 P350.7 R315.1 R318.2 U303.10(OUT) U303.11(OUT) U303.12(OUT)
ESP_ALERT: R314.1 U302.12(ALERT)
ESP_DEN0: R303.2
ESP_DEN1: R325.2
ESP_DEN2: R301.2
ESP_DEN3: R316.2
ESP_IN0: D306.2(A) R306.1
ESP_IN1: D307.2(A) R327.1
ESP_IN2: D308.2(A) R304.1
ESP_IN3: D309.2(A) R317.1
NetC304_1: C304.1 R307.1
NetC305_1: C305.1 R310.1
NetC308_2: C308.2 U302.8(DECAP)
NetC312_1: C312.1 R324.1
NetC314_1: C314.1 R330.1
NetD302_1: D302.1(A) R312.1
NetD303_1: D303.1(A) R313.1
NetD306_1: D306.1(K) R319.2
NetD307_1: D307.1(K) R320.2
NetD308_1: D308.1(K) R321.2
NetD309_1: D309.1(K) R322.2
NetD310_1: D310.1(A) R329.1
NetD311_1: D311.1(A) R332.1
NetQ300_3: Q300.3(C) R302.2
NetQ301_3: Q301.3(C) R323.2
NetQ302_3: Q302.3(C) R300.2
NetQ303_3: Q303.3(C) R315.2
NetR301_1: R301.1 U300.5(DEN)
NetR303_1: R303.1 U301.5(DEN)
NetR304_2: R304.2 U300.4(IN)
NetR306_2: R306.2 U301.4(IN)
NetR312_2: R312.2 U300.3(GND)
NetR313_2: R313.2 U301.3(GND)
NetR316_1: R316.1 U303.5(DEN)
NetR317_2: R317.2 U303.4(IN)
NetR325_1: R325.1 U304.5(DEN)
NetR327_2: R327.2 U304.4(IN)
NetR329_2: R329.2 U303.3(GND)
NetR332_2: R332.2 U304.3(GND)

Not connected (* = marked no-connect by the designer): D302 2(NC)*; D303 2(NC)*; D310 2(NC)*; D311 2(NC)*; U300 1(NC)* 2(NC)* 7(NC)* 8(NC)* 9(NC)* 13(NC)* 14(NC)*; U301 1(NC)* 2(NC)* 7(NC)* 8(NC)* 9(NC)* 13(NC)* 14(NC)*; U302 5(AIN6/GPIO6)* 6(AIN7/GPIO7)*; U303 1(NC)* 2(NC)* 7(NC)* 8(NC)* 9(NC)* 13(NC)* 14(NC)*; U304 1(NC)* 2(NC)* 7(NC)* 8(NC)* 9(NC)* 13(NC)* 14(NC)*

### Notes on the sheet
- CMP-2002-07353-1

### Library data of the parts
C300 C301 C309 C310 = CMP-2008-04639-2: Chip Multilayer Ceramic Capacitors for General Purpose, 0402, 0.10uF, X7R, 15%, 10%, 50V; Dissipation Factor: 0.025%; Capacitance: 100nF; Weight: 0.000212oz; Thickness: 0.022inch; Voltage Rating (DC): 50V; Dielectric Material: Ceramic; Termination: SMD/SMT; Case/Package: 0402; Case Code (Imperial): 0402; Mount: Surface Mount; REACH SVHC: No SVHC; Resistor Type: Ceramic; Dielectric: X7R; Max Operating Temperature: 125°C; Voltage: 50V; Lead Free: Lead Free; Package Quantity: 10000; Packaging: Tape and Reel; Length: 1mm; Material: Ceramic; Height: 0.5mm; Depth: 0.5mm; Width: 0.5mm; Min Operating Temperature: -55°C; Tolerance: 10%; Case Code (Metric): 1005; Voltage Rating: 50V
C302 C303 C311 C313 = CMP-2008-04637-5: Chip Multilayer Ceramic Capacitors for General Purpose, 0402, 10000pF, X7R, 15%, 10%, 50V; Voltage: 25V; Capacitance: 10nF; Tolerance: 10%; Mount: Surface Mount; Lead Free: Lead Free; Radiation Hardening: No; Case Code (Imperial): 0402; REACH SVHC: No SVHC; Case/Package: 0402; Dielectric: X7R; Voltage Rating (DC): 50V; Max Operating Temperature: 125°C; Termination: SMD/SMT; Material: Ceramic; Width: 0.02inch; Package Quantity: 1; Voltage Rating: 50V; Thickness: 0.022inch; Packaging: Tape and Reel; Height: 0.5mm; Number of Pins: 2; Case Code (Metric): 1005; Min Operating Temperature: -55°C; Length: 1mm; Depth: 0.5mm
C304 C305 C312 C314 = CMP-2008-03284-2: CAP CER 100PF 50V C0G/NP0 0402; Manufacturer: Kemet; Manufacturer Part Number: C0402C101J5GACTU; Tolerance: 0.05; Temperature Characteristic: C0G; Temperature Coefficient: 15%; Material: Ceramic; Digikey Description: CAP CER 100PF 50V C0G/NP0 0402; Lead Free: Yes; Capacitance: 100 pF; Device Class L3: Ceramic Capacitors; Mouser Description: Multilayer Ceramic Capacitors MLCC - SMD/SMT 50volts 100pF C0G 5%; Octopart: https://octopart.com/c0402c101j5gactu-kemet-132471; Temperature Range Low: -55°C; Value: 100 pF; Automotive: No; Height: 0.55mm; Category: Cap; ComponentLink2URL: https://content.kemet.com/datasheets/KEM_C1002_X7R_SMD.pdf; RoHS: TRUE; Ipc Land Pattern Name: CAPC10050X50; Temperature Range High: +125°C; Device Class L2: Capacitors; Package: C0402-BB; ComponentLink2Description: Datasheet; Temperature: -55°C to +125°C; Voltage Rating: 50 V; Device Class L1: Passive Components
C306-C308 = CMP-2000-06336-1: Chip Capacitor, 1 uF, +/- 10%, 10 V, -55 to 85 degC, 0603 (1608 Metric), RoHS, Tape and Reel; Manufacturer: Murata; Dielectric: X5R; Voltage Rating: 10V; Case Height: 0.8mm; Temperature Coefficient / Code: +/-15%; Type: GeneralPurposeMLCC; Brand: MurataElectronics; Case Length: 1.6mm; Capacitance - nF: 1000nF; Package Description: 2-Pin Surface Mount Device, Body 1.6 x 0.8 mm; Maximum Operating Temperature: +85C; Minimum Operating Temperature: -55C; Mounting Technology: SurfaceMount; RoHS: Details; Package Reference: 0603; Product: GeneralTypeMLCCs; Packaging: Reel; Case Code - mm: 1608; Manufacturer URL: http://www.murata.com/; Dimensions: 0.8mmWx1.6mmLx0.8mmH; Factory Pack Quantity: 4000; Case Code - in: 0603; Tolerance: 10%; Product Category: MultilayerCeramicCapacitorsMLCC-SMD/SMT; Capacitance: 1uF; Series: GRM; Datasheet Version: 02/2016; Case Width: 0.8mm; Operating Temperature Range: -55Cto+85C; Datasheet URL: http://search.murata.co.jp/Ceramy/image/img/A01X/G101/ENG/GRM188R61A105KA61-01.pdf; Package / Case: 0603(1608metric); Termination Style: SMD/SMT; Voltage Rating DC: 10V
D300 D301 D304 D305 = CMP-1060-00377-1: Zener Voltage Regulator, 500 mW, 2-Pin SOD-123, Pb-Free, Tape and Reel; Manufacturer: On Semiconductor; VZ Typ (V): 56; P Max (W): 0.5; DatasheetVersion: Rev. 12; PackageReference: SOD-123-2-425-04; Mounting Technology: Surface Mount; ComponentLink3URL: http://www.onsemi.com/pub_link/Collateral/425-04.PDF; ComponentLink1Description: Manufacturer URL; ComponentLink3Description: Package Specification; PartNumber: MMSZ5263BT1G; PackageDescription: 2-Pin SOD, Body 1.6 x 2.69 mm; Packing: Tape and Reel; ComponentLink1URL: http://www.onsemi.com/; RoHS: Pb-Free; ComponentLink2Description: Datasheet; ComponentLink2URL: http://www.onsemi.com/pub_link/Collateral/MMSZ5221BT1-D.PDF; PackageVersion: Rev. G, 10/2009
D302 D303 D310 D311 = CMP-12791-000036-1: DIODE GEN PURP 200V 200MA SOT23; Manufacturer: Diodes Inc.; Max Repetitive Reverse Voltage: 250V; Forward Current: 400mA; Max Surge Forward Current: 0.5A; Standoff Height: 0.013mm; Capacitance: 5pF; Max Junction Temp: +150°C; Peak Reverse Current: 0.1uA; Value: 5pF; Device Class L1: Discrete Semiconductors; Category: Diode; Mouser Description: Diodes - General Purpose, Power, Switching 200V 350mW; Digikey Description: DIODE GEN PURP 200V 200MA SOT23; Manufacturer Part Number: BAS21-7-F; Device Class L2: Diodes; RoHS: TRUE; Device Class L3: Rectifier Diodes; Lead Free: Yes; Temperature Range High: +150°C; Ipc Land Pattern Name: SOT92P240X102-3; ComponentLink2Description: Datasheet; Octopart: https://octopart.com/bas21-7-f-diodes+inc.-325943; Reverse Voltage: 200V; Height: 1.1mm; Automotive: No; ComponentLink2URL: https://www.diodes.com/assets/Datasheets/Ds12004.pdf; Temperature: -65°C to +150°C; Temperature Range Low: -65°C; Footprint Url: https://www.diodes.com/assets/Package-Files/SOT23.pdf; Package: SOT23
D306-D309 = CMP-1426-00009-6: WL-SMCW SMT Mono-Color Chip LED Waterclear; Max Junction Temperature (Tj): 95°C; Max Reverse Voltage (DC): 5V; Luminous Intensity: 40mcd; Color: Green; Peak Wavelength: 572nm; Wavelength: 570nm; Viewing Angle: 140°; Power Dissipation: 72mW; Forward Current: 100mA; Test Current: 20mA; Forward Voltage: 2V; Lens Style: Clear, Rectangular; Reverse Voltage: 5V; Length: 2mm; RoHS: Compliant; Min Operating Temperature: -40°C; REACH SVHC: Unknown; Packaging: Tape and Reel; Case/Package: 0805; Max Operating Temperature: 85°C; Case Code (Metric): 2012; Width: 1.25mm; Dominant Wavelength: 570nm; Mount: Surface Mount; Case Code (Imperial): 0805; Height: 700µm
P350 = CMP-1502-01078-4: THT Vertical Pin Header WR-PHD, Pitch 2.54 mm, Dual Row, 8 pins; Number of Contacts: 8; Gender: Male; Connector Type: Male Pin; Current Rating: 3A; Row Spacing: 2.54mm; Contact Resistance: 20mΩ; Voltage Rating: 250V; Number of Pins: 8; Lead Pitch: 2.54mm; Mount: Through Hole; Lead Free: Lead Free; Contact Material: Gold; Number of Positions: 8; Min Operating Temperature: -40°C; RoHS: Compliant; Termination: Solder; Packaging: Bulk; Max Operating Temperature: 105°C; Operating Supply Voltage: 250V; Contact Mating Length: 5.9944mm; Height: 8.89mm; Color: Black; Pitch: 2.54mm; Number of Rows: 2; Orientation: Vertical; Contact Plating: Gold
Q300-Q303 = CMP-14406-000022-1: TRANS NPN 40V 0.2A 3DFN
R300 R302 R315 R323 = CMP-2002-07464-1: Manufacturer: Yageo / Phycomp; Part Number: RC0402FR-071K5L
R301 R303 R304 R306 R307 R310 R314 R316 R317 R324 R325 R327 R330 = CMP-2002-07353-1: Part Number: RC0402FR-0710KL; Manufacturer: Yageo / Phycomp
R305 R308 R318 R328 = CMP-2002-07701-1: Part Number: RC0402FR-0747KL; Manufacturer: Yageo / Phycomp
R309 R311 R326 R331 = CMP-2002-07456-1: Part Number: RC0402FR-071K2L; Manufacturer: Yageo / Phycomp
R312 R313 R329 R332 = CMP-2002-07055-1: Part Number: RC0402FR-0727RL; Manufacturer: Yageo / Phycomp
R319-R322 = CMP-2002-07613-1: Thick Film Resistors - SMD General Purpose Chip Resistor 0402, 330 Ohms, 1%, 1/16W; Part Number: RC0402FR-07330RL; Manufacturer: Yageo / Phycomp; Supplier: Farnell; Supplier Part Number: RC0402FR-07330RL
U300 U301 U303 U304 = CMP-32849-000085-1: IC PWR SWITCH N-CHAN 1:1 DSO-14; Fault Protection: Over Voltage; Max Supply Voltage: 36V; Supply Current: 2mA; Interface: On/Off; Output Configuration: High Side; Max Power Dissipation: 1.6W; Number of Outputs: 1; Max Output Current: 9A; RoHS Compliant: Yes; Series: -; Max Operating Temperature: 150°C; Lead Free: Lead Free; Number of Channels: 1; Nominal Supply Current: 2mA; Min Operating Temperature: -40°C; Mount: Surface Mount; Packaging: Cut Tape; Number of Pins: 14; Halogen Free: Halogen Free
U302 = CMP-04860-000052-2: IC ADC 12BIT SAR 16WQFN; Manufacturer Lifecycle Status: ACTIVE; NexarPartId: 103121062; Max Supply Voltage: 5.5V; Number of Converters: 1; Min Supply Voltage: 1.65V; Interface: I2C; Max Junction Temperature (Tj): 125°C; Number of Channels: 8; Height: 800µm; Lifecycle Status: Production; Width: 3mm; Thickness: 750µm; Min Operating Temperature: -40°C; Number of Pins: 16; Ambient Temperature Range High: 85°C; Max Operating Temperature: 85°C; Length: 3mm

## Sheet Sheet4.SchDoc
size A3; SheetNumber: 4; SheetTotal: 6
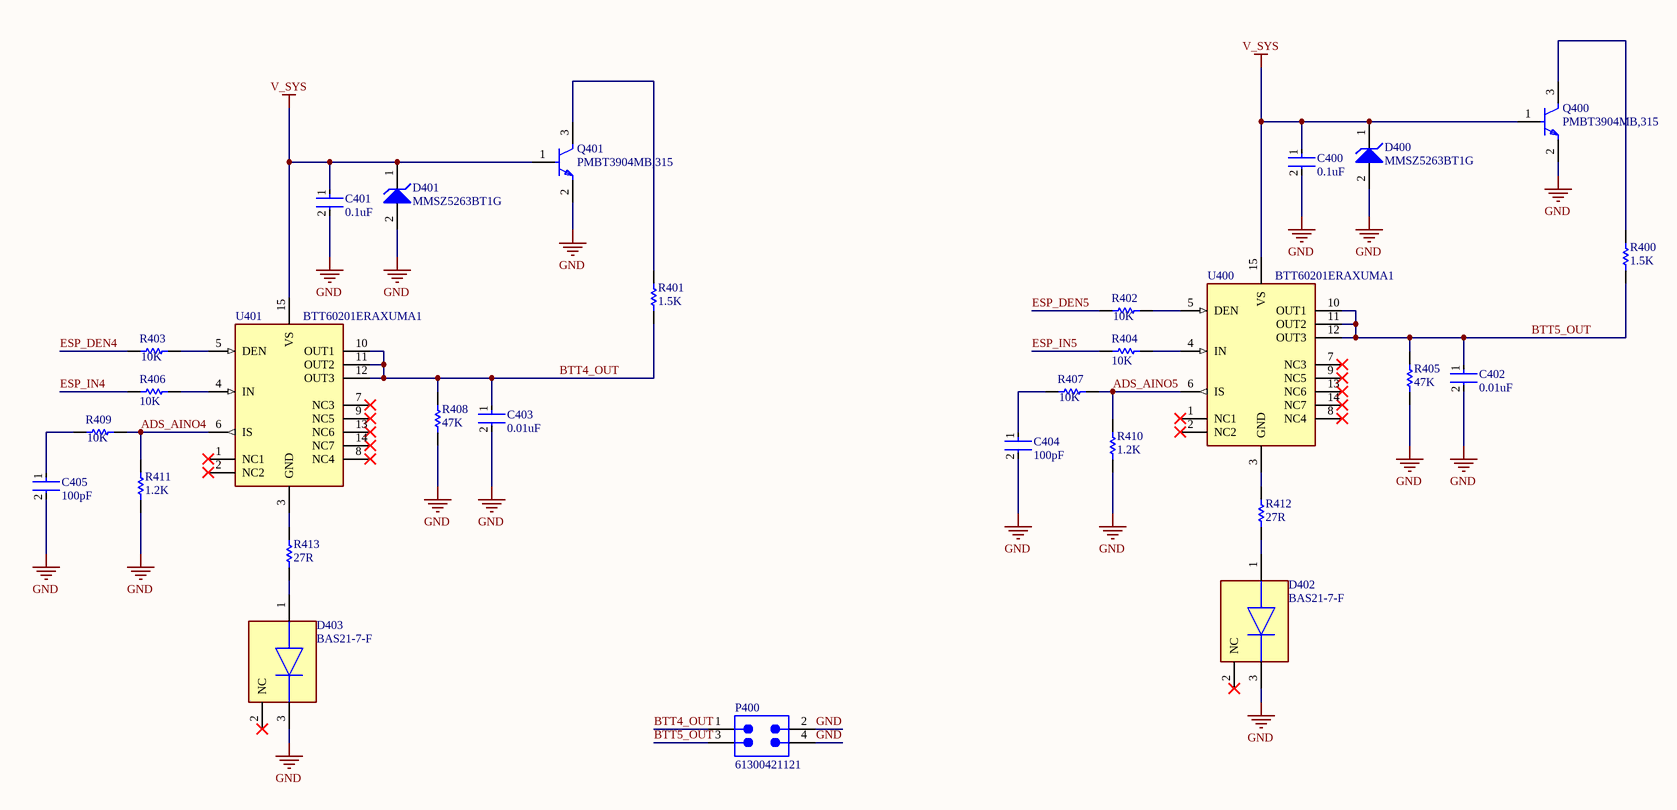
[diagram p4: Sheet4.SchDoc]

### Parts
C400  0.1uF  [FP-GRM155-0_05-IPC_B]
C401  0.1uF  [FP-GRM155-0_05-IPC_B]
C402  0.01uF  [FP-GRM155-0_05-IPC_C]
C403  0.01uF  [FP-GRM155-0_05-IPC_C]
C404  100pF  [FP-C0402-BB-MFG]
C405  100pF  [FP-C0402-BB-MFG]
D400  MMSZ5263BT1G  [ONSC-SOD-123-2-425-04_V]
D401  MMSZ5263BT1G  [ONSC-SOD-123-2-425-04_V]
D402  BAS21-7-F  [FP-SOT23-MFG]
D403  BAS21-7-F  [FP-SOT23-MFG]
P400  61300421121  [61300421121]
Q400  PMBT3904MB,315  [FP-SOT883B-MFG]
Q401  PMBT3904MB,315  [FP-SOT883B-MFG]
R400  1.5K  [RESC1005X40X25ML05T10]
R401  1.5K  [RESC1005X40X25ML05T10]
R402  10K  [RESC1005X40X25LL05T10]
R403  10K  [RESC1005X40X25LL05T10]
R404  10K  [RESC1005X40X25LL05T10]
R405  47K  [RESC1005X40X25ML05T10]
R406  10K  [RESC1005X40X25LL05T10]
R407  10K  [RESC1005X40X25LL05T10]
R408  47K  [RESC1005X40X25ML05T10]
R409  10K  [RESC1005X40X25LL05T10]
R410  1.2K  [RESC1005X40X25ML05T10]
R411  1.2K  [RESC1005X40X25ML05T10]
R412  27R  [RESC1005X40X25LL05T10]
R413  27R  [RESC1005X40X25LL05T10]
U400  BTT60201ERAXUMA1  [BTT60201ERAXUMA1]
U401  BTT60201ERAXUMA1  [BTT60201ERAXUMA1]

### Nets
GND: C400.2 C401.2 C402.2 C403.2 C404.2 C405.2 D400.2(A) D401.2(A) D402.3(C) D403.3(C) P400.2 P400.4 Q400.2(E) Q401.2(E) R405.1 R408.1 R410.1 R411.1
V_SYS: C400.1 C401.1 D400.1(K) D401.1(K) Q400.1(B) Q401.1(B) U400.15(VS) U401.15(VS)
ADS_AINO4: R409.2 R411.2 U401.6(IS)
ADS_AINO5: R407.2 R410.2 U400.6(IS)
BTT4_OUT: C403.1 P400.1 R401.1 R408.2 U401.10(OUT1) U401.11(OUT2) U401.12(OUT3)
BTT5_OUT: C402.1 P400.3 R400.1 R405.2 U400.10(OUT1) U400.11(OUT2) U400.12(OUT3)
ESP_DEN4: R403.1
ESP_DEN5: R402.1
ESP_IN4: R406.1
ESP_IN5: R404.1
NetC404_1: C404.1 R407.1
NetC405_1: C405.1 R409.1
NetD402_1: D402.1(A) R412.1
NetD403_1: D403.1(A) R413.1
NetQ400_3: Q400.3(C) R400.2
NetQ401_3: Q401.3(C) R401.2
NetR402_2: R402.2 U400.5(DEN)
NetR403_2: R403.2 U401.5(DEN)
NetR404_2: R404.2 U400.4(IN)
NetR406_2: R406.2 U401.4(IN)
NetR412_2: R412.2 U400.3(GND)
NetR413_2: R413.2 U401.3(GND)

Not connected (* = marked no-connect by the designer): D402 2(NC)*; D403 2(NC)*; U400 1(NC1)* 2(NC2)* 7(NC3)* 8(NC4)* 9(NC5)* 13(NC6)* 14(NC7)*; U401 1(NC1)* 2(NC2)* 7(NC3)* 8(NC4)* 9(NC5)* 13(NC6)* 14(NC7)*

### Library data of the parts
C400 C401 = CMP-2008-04639-2: as C300 on sheet Sheet3; Weight: 0.000212oz; Thickness: 0.022inch; Voltage Rating (DC): 50V; Dielectric Material: Ceramic; Termination: SMD/SMT; Case/Package: 0402; Case Code (Imperial): 0402; Mount: Surface Mount; REACH SVHC: No SVHC; Resistor Type: Ceramic; Dielectric: X7R; Max Operating Temperature: 125°C; Voltage: 50V; Lead Free: Lead Free; Package Quantity: 10000; Packaging: Tape and Reel; Length: 1mm; Material: Ceramic; Height: 0.5mm; Depth: 0.5mm; Width: 0.5mm; Min Operating Temperature: -55°C; Tolerance: 10%; Case Code (Metric): 1005; Voltage Rating: 50V
C402 C403 = CMP-2008-04637-5: as C302 on sheet Sheet3; Tolerance: 10%; Mount: Surface Mount; Lead Free: Lead Free; Radiation Hardening: No; Case Code (Imperial): 0402; REACH SVHC: No SVHC; Case/Package: 0402; Dielectric: X7R; Voltage Rating (DC): 50V; Max Operating Temperature: 125°C; Termination: SMD/SMT; Material: Ceramic; Width: 0.02inch; Package Quantity: 1; Voltage Rating: 50V; Thickness: 0.022inch; Packaging: Tape and Reel; Height: 0.5mm; Number of Pins: 2; Case Code (Metric): 1005; Min Operating Temperature: -55°C; Length: 1mm; Depth: 0.5mm
C404 C405 = CMP-2008-03284-2: as C304 on sheet Sheet3; Digikey Description: CAP CER 100PF 50V C0G/NP0 0402; Lead Free: Yes; Capacitance: 100 pF; Device Class L3: Ceramic Capacitors; Mouser Description: Multilayer Ceramic Capacitors MLCC - SMD/SMT 50volts 100pF C0G 5%; Octopart: https://octopart.com/c0402c101j5gactu-kemet-132471; Temperature Range Low: -55°C; Value: 100 pF; Automotive: No; Height: 0.55mm; Category: Cap; ComponentLink2URL: https://content.kemet.com/datasheets/KEM_C1002_X7R_SMD.pdf; RoHS: TRUE; Ipc Land Pattern Name: CAPC10050X50; Temperature Range High: +125°C; Device Class L2: Capacitors; Package: C0402-BB; ComponentLink2Description: Datasheet; Temperature: -55°C to +125°C; Voltage Rating: 50 V; Device Class L1: Passive Components
D400 D401 = CMP-1060-00377-1: as D300 on sheet Sheet3; DatasheetVersion: Rev. 12; PackageReference: SOD-123-2-425-04; Mounting Technology: Surface Mount; ComponentLink3URL: http://www.onsemi.com/pub_link/Collateral/425-04.PDF; ComponentLink1Description: Manufacturer URL; ComponentLink3Description: Package Specification; PartNumber: MMSZ5263BT1G; PackageDescription: 2-Pin SOD, Body 1.6 x 2.69 mm; Packing: Tape and Reel; ComponentLink1URL: http://www.onsemi.com/; RoHS: Pb-Free; ComponentLink2Description: Datasheet; ComponentLink2URL: http://www.onsemi.com/pub_link/Collateral/MMSZ5221BT1-D.PDF; PackageVersion: Rev. G, 10/2009
D402 D403 = CMP-12791-000036-1: as D302 on sheet Sheet3; Device Class L1: Discrete Semiconductors; Category: Diode; Mouser Description: Diodes - General Purpose, Power, Switching 200V 350mW; Digikey Description: DIODE GEN PURP 200V 200MA SOT23; Manufacturer Part Number: BAS21-7-F; Device Class L2: Diodes; RoHS: TRUE; Device Class L3: Rectifier Diodes; Lead Free: Yes; Temperature Range High: +150°C; Ipc Land Pattern Name: SOT92P240X102-3; ComponentLink2Description: Datasheet; Octopart: https://octopart.com/bas21-7-f-diodes+inc.-325943; Reverse Voltage: 200V; Height: 1.1mm; Automotive: No; ComponentLink2URL: https://www.diodes.com/assets/Datasheets/Ds12004.pdf; Temperature: -65°C to +150°C; Temperature Range Low: -65°C; Footprint Url: https://www.diodes.com/assets/Package-Files/SOT23.pdf; Package: SOT23
P400 = CMP-1502-01066-5: THT Vertical Pin Header WR-PHD, Pitch 2.54 mm, Dual Row, 4 pins; Row Spacing: 2.54mm; Gender: Male; Number of Contacts: 4; Contact Resistance: 20mΩ; Connector Type: Male Pin; Voltage Rating: 250V; Current Rating: 3A; Height: 8.89mm; Termination: Solder; RoHS: Compliant; Color: Black; Max Operating Temperature: 105°C; Min Operating Temperature: -40°C; Contact Material: Gold; Pitch: 2.54mm; Lead Pitch: 2.54mm; Contact Plating: Gold; Number of Pins: 4; Mount: Through Hole; Number of Rows: 2; Number of Positions: 4; Orientation: Vertical; Operating Supply Voltage: 250V; Lead Free: Lead Free; Contact Mating Length: 5.9944mm; Packaging: Bulk
Q400 Q401 = CMP-14406-000022-1: TRANS NPN 40V 0.2A 3DFN
R400 R401 = CMP-2002-07464-1: as R300 on sheet Sheet3
R402-R404 R406 R407 R409 = CMP-2002-07353-1: as R301 on sheet Sheet3
R405 R408 = CMP-2002-07701-1: as R305 on sheet Sheet3
R410 R411 = CMP-2002-07456-1: as R309 on sheet Sheet3
R412 R413 = CMP-2002-07055-1: as R312 on sheet Sheet3
U400 U401 = BTT60201ERAXUMA1: Power Switch ICs – Power Distribution; INFINEON; BTT60201ERAXUMA1; 1; 7 A; Max Junction Temperature (Tj): 150°C; Max Output current: 7A; Max Power Dissipation: 1.6W; Max Supply Current: 9mA; Max Supply Voltage: 48V; Min Supply Voltage: 5V; Number of Circuits: 1; Operating Supply Voltage: 8V; Supplier: Farnell; Supplier Part Number: BTT60201ERAXUMA1; Manufacturer: Infineon; Manufacturer Part Number: BTT60201ERAXUMA1; RoHS: Compliant; Category: Power Switch ICs - Power Distribution; Stock: 7297; Pricing: 5=4,52, 50=2,78, 100=2,42, 500=2, 1500=1,67 (EUR); Height: 1.15mm; Height - Seated (Max): 1.15mm; Length: 8.65mm; Lifecycle Status: Production; Max Operating Temperature: 150°C; Min Operating Temperature: -40°C; Number of Outputs: 1; Number of Terminals: 14; Output Current: 7A; Ratings: AEC-Q100; REACH SVHC: Yes; Schedule B: 8542390000, 8542390000|8542390000|8542390000|8542390000|8542390000; Terminal Pitch: 1.27mm; Width: 3.9mm; ComponentLink1URL: https://datasheet.octopart.com:443/BTT60201ERAXUMA1-Infineon-datasheet-180055284.pdf?src-supplier=IHS; ComponentLink1Description: https://datasheet.octopart.com:443/BTT60201ERAXUMA1-Infineon-datasheet-180055284.pdf?src-supplier=IHS; ComponentLink2URL: http://sigma.octopart.com:80/conflict_mineral_statement/Infineon-company-51.pdf?src-supplier=Compliance+Statements; ComponentLink2Description: http://sigma.octopart.com:80/conflict_mineral_statement/Infineon-company-51.pdf?src-supplier=Compliance+Statements

## Sheet Sheet5.SchDoc
size A4; SheetNumber: 5; SheetTotal: 6
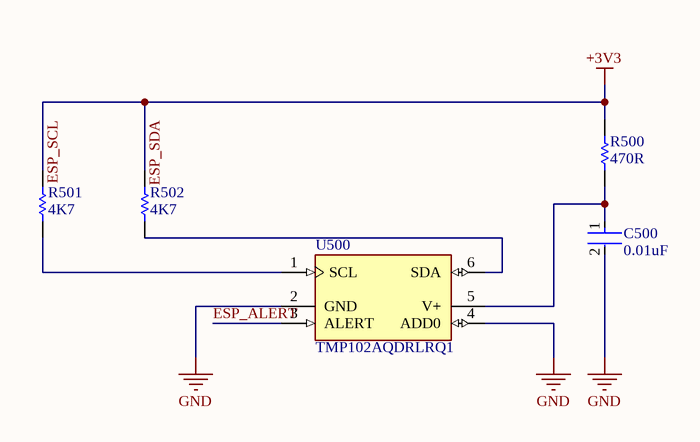
[diagram p5: Sheet5.SchDoc]

### Parts
C500  0.01uF  [FP-GRM155-0_05-IPC_C]
R500  470R  [RESC1005X40X25ML05T10]
R501  4K7  [RESC1005X40X25NL05T10]
R502  4K7  [RESC1005X40X25NL05T10]
U500  TMP102AQDRLRQ1  [FP-DRL0006A-MFG]

### Nets
ESP_SCL: R500.2 R501.2 R502.2  [also labelled +3V3, ESP_SDA]
GND: C500.2 U500.2(GND) U500.4(ADD0)
ESP_ALERT: U500.3(ALERT)
NetC500_1: C500.1 R500.1 U500.5(V+)
NetR501_1: R501.1 U500.1(SCL)
NetR502_1: R502.1 U500.6(SDA)

### Library data of the parts
C500 = CMP-2008-04637-5: as C302 on sheet Sheet3; Tolerance: 10%; Mount: Surface Mount; Lead Free: Lead Free; Radiation Hardening: No; Case Code (Imperial): 0402; REACH SVHC: No SVHC; Case/Package: 0402; Dielectric: X7R; Voltage Rating (DC): 50V; Max Operating Temperature: 125°C; Termination: SMD/SMT; Material: Ceramic; Width: 0.02inch; Package Quantity: 1; Voltage Rating: 50V; Thickness: 0.022inch; Packaging: Tape and Reel; Height: 0.5mm; Number of Pins: 2; Case Code (Metric): 1005; Min Operating Temperature: -55°C; Length: 1mm; Depth: 0.5mm
R500 = CMP-2002-07697-1: Part Number: RC0402FR-07470RL; Manufacturer: Yageo / Phycomp
R501 R502 = CMP-1011-00586-2: Manufacturer: Yageo / Phycomp; Part Number: RC0402FR-074K7L
U500 = CMP-04948-000031-1: SENSOR DIGITAL -40C-125C 6SOT; Output Type: I2C; Operating Supply Voltage: 3.6V; Quiescent Current: 10uA; Resolution: 11b; Mount: Surface Mount; Max Operating Temperature: 125°C; Case/Package: SOT-563; Lead Free: Lead Free; Min Operating Temperature: -40°C; Packaging: Tape and Reel; Interface: I2C; Number of Pins: 6; RoHS Compliant: Yes